# EAGLE design control_unit-smd (EAGLE 5.11)

## Sheet 1 of 4
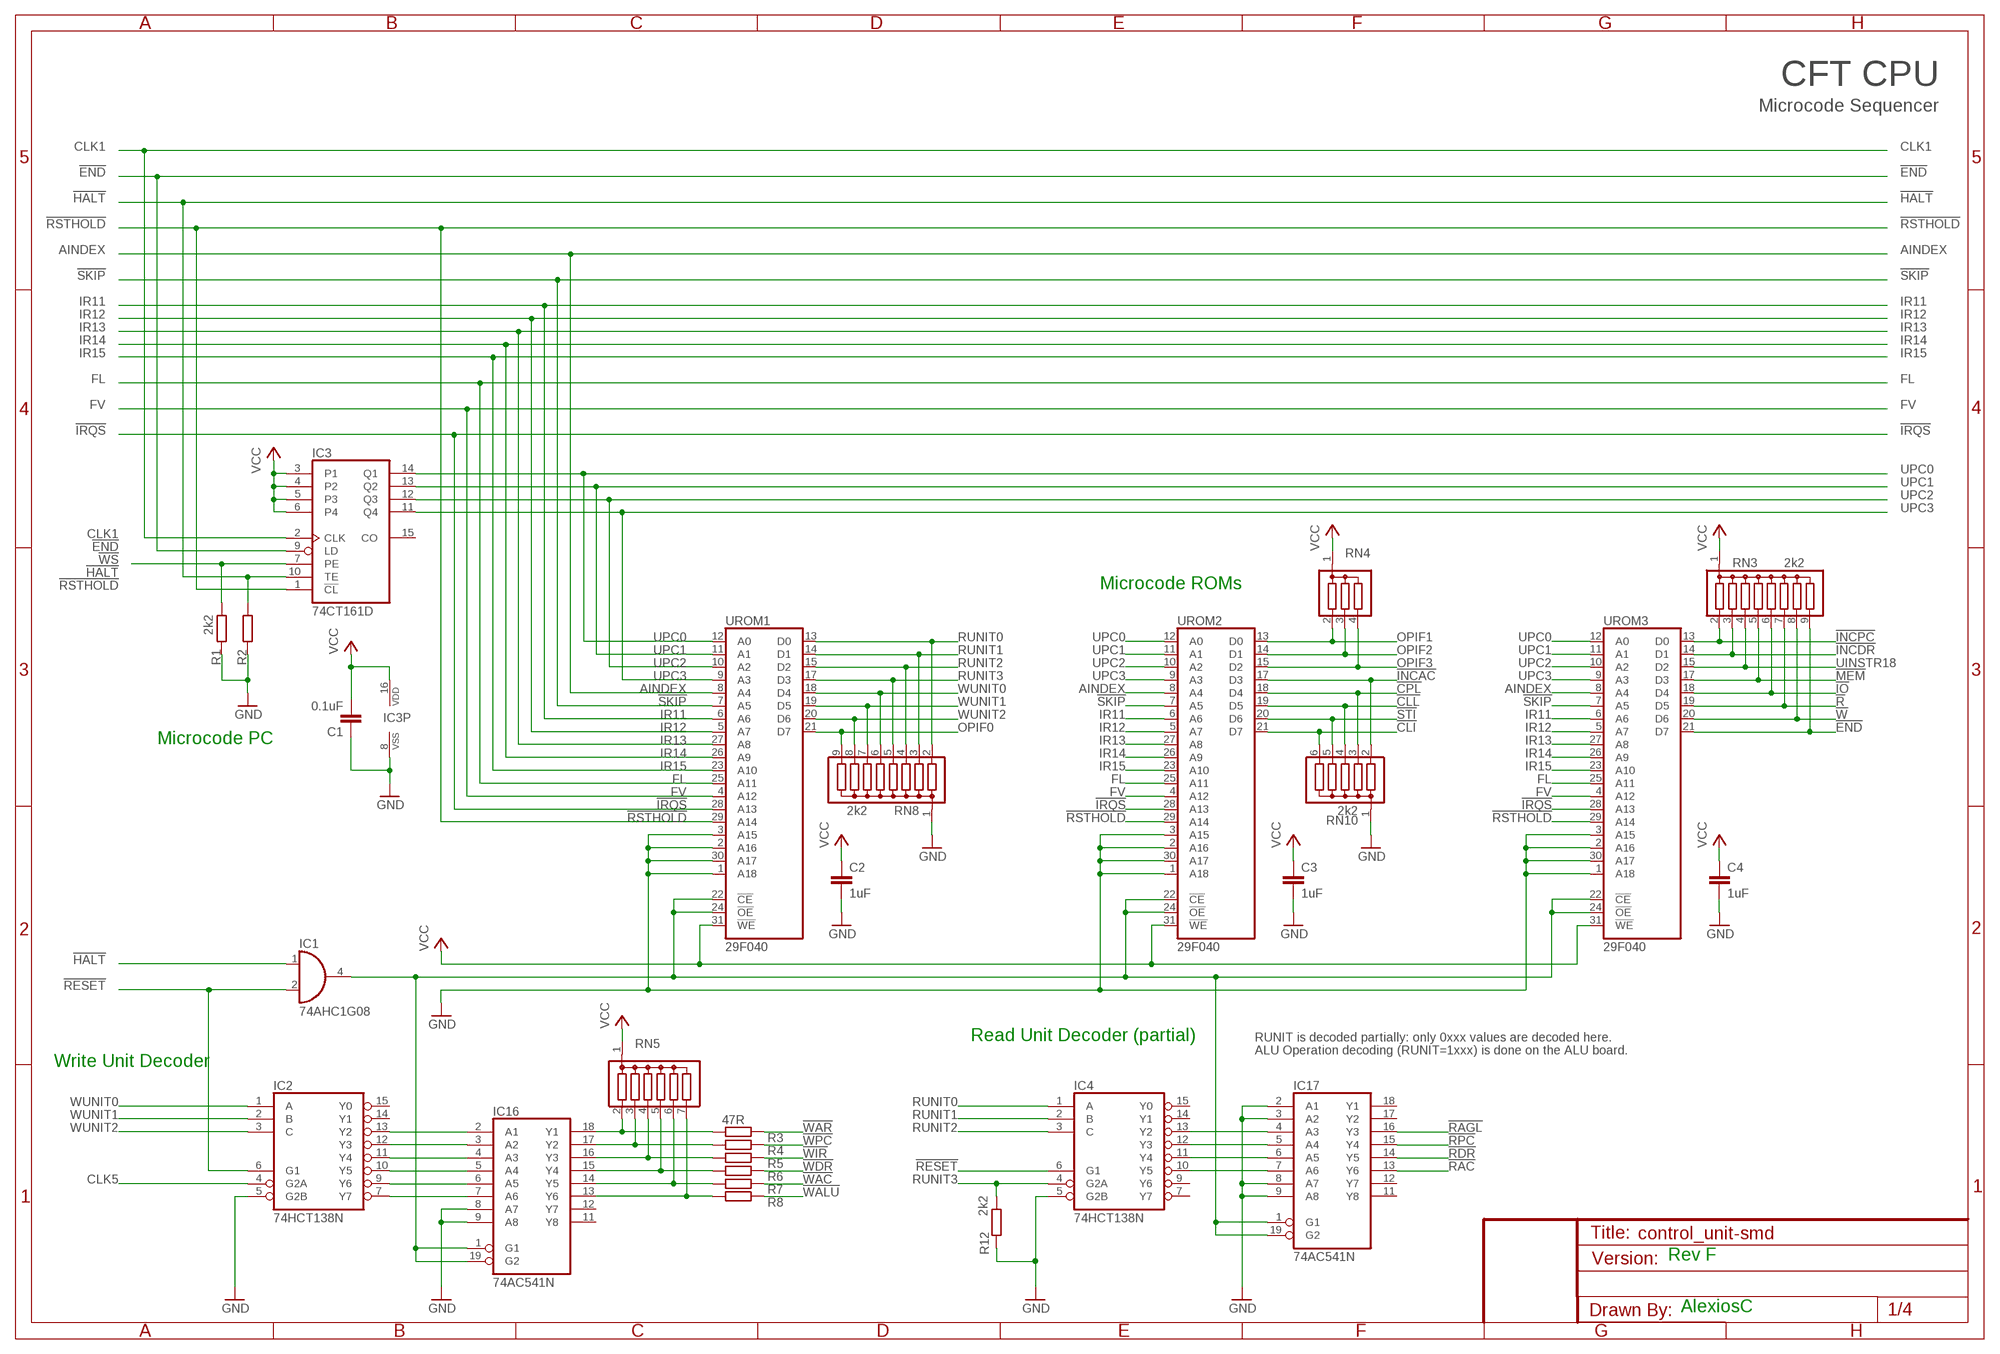
[diagram p0: schematic, sheet 1]

### Parts
C1  0.1uF  C-EUC0805K  [C0805K]
C2  1uF  C-EUC0805K  [C0805K]
C3  1uF  C-EUC0805K  [C0805K]
C4  1uF  C-EUC0805K  [C0805K]
IC1  74AHC1G08  74AHC1G08DBV  [SOT23-5]
IC2  74HCT138N  [DIL16]
IC3  74CT161D  4161P  [DIL16]
IC4  74HCT138N  [DIL16]
IC16  74AC541N  [DIL20]
IC17  74AC541N  [DIL20]
R1  2k2  R-EU_R0805W  [R0805W]
R2  2k2  R-EU_R0805W  [R0805W]
R3  47R  R-EU_R0805W  [R0805W]
R4  47R  R-EU_R0805W  [R0805W]
R5  47R  R-EU_R0805W  [R0805W]
R6  47R  R-EU_R0805W  [R0805W]
R7  47R  R-EU_R0805W  [R0805W]
R8  47R  R-EU_R0805W  [R0805W]
R12  2k2  R-EU_R0805W  [R0805W]
RN3  2k2  G08R  [SIL9]
RN4  G03R  [SIL4]
RN5  G06R  [SIL7]
RN8  2k2  G08R  [SIL9]
RN10  2k2  G05R  [SIL6]
UROM1  29F040  29F040DIP32  [DIL32]
UROM2  29F040  29F040DIP32  [DIL32]
UROM3  29F040  29F040DIP32  [DIL32]

### Nets
!CLI: RN10.6 UROM2.21(D7) ; also sheet 4
!CLL: RN10.4 UROM2.19(D5) ; also sheet 4
!CPL: RN10.3 UROM2.18(D4) ; also sheet 4
!END: IC3.9(LD) RN3.9 UROM3.21(D7) ; also sheet 4
!HALT: IC1.1(I0) IC3.10(TE) R2.2 ; also sheet 4
!INCAC: RN10.2 UROM2.17(D3) ; also sheet 4
!INCDR: RN3.3 UROM3.14(D1) ; also sheet 4
!INCPC: RN3.2 UROM3.13(D0) ; also sheet 4
!IO: RN3.6 UROM3.18(D4) ; also sheet 4
!IRQS: UROM1.28(A13) UROM2.28(A13) UROM3.28(A13) ; also sheet 4
!MEM: RN3.5 UROM3.17(D3) ; also sheet 4
!R: RN3.7 UROM3.19(D5) ; also sheet 4
!RAC: IC17.13(Y6) ; also sheet 4
!RAGL: IC17.16(Y3) ; also sheet 3
!RDR: IC17.14(Y5) ; also sheet 4
!RESET: IC1.2(I1) IC2.6(G1) IC4.6(G1) ; also sheet 2,3,4
!RPC: IC17.15(Y4) ; also sheet 4
!RSTHOLD: IC3.1(!CL) UROM1.29(A14) UROM2.29(A14) UROM3.29(A14) ; also sheet 4
!SKIP: UROM1.7(A5) UROM2.7(A5) UROM3.7(A5) ; also sheet 2
!STI: RN10.5 UROM2.20(D6) ; also sheet 4
!UCE: IC1.4(O) IC16.1(G1) IC16.19(G2) IC17.1(G1) IC17.19(G2) UROM1.22(!CE) UROM1.24(!OE) UROM2.22(!CE) UROM2.24(!OE) UROM3.22(!CE) UROM3.24(!OE)
!W: RN3.8 UROM3.20(D6) ; also sheet 4
!WAC: R7.2 ; also sheet 4
!WALU: R8.2 ; also sheet 4
!WAR: R3.2 ; also sheet 4
!WDR: R6.2 ; also sheet 4
!WIR: R5.2 ; also sheet 3,4
!WPC: R4.2 ; also sheet 4
!WS: IC3.7(PE) R1.2 ; also sheet 4
AINDEX: UROM1.8(A4) UROM2.8(A4) UROM3.8(A4) ; also sheet 4
CLK1: IC3.2(CLK) ; also sheet 2,4
CLK5: IC2.4(G2A) ; also sheet 4
FL: UROM1.25(A11) UROM2.25(A11) UROM3.25(A11) ; also sheet 2,4
FV: UROM1.4(A12) UROM2.4(A12) UROM3.4(A12) ; also sheet 2,4
GND [Power]: C1.1 C2.2 C3.2 C4.2 IC2.5(G2B) IC3.8(VSS) IC4.5(G2B) IC16.8(A7) IC16.9(A8) IC17.2(A1) IC17.3(A2) IC17.8(A7) IC17.9(A8) R1.1 R2.1 R12.1 RN8.1 RN10.1 UROM1.1(A18) UROM1.2(A16) UROM1.3(A15) UROM1.30(A17) UROM2.1(A18) UROM2.2(A16) UROM2.3(A15) UROM2.30(A17) UROM3.1(A18) UROM3.2(A16) UROM3.3(A15) UROM3.30(A17) ; also sheet 2,3,4
IR11: UROM1.6(A6) UROM2.6(A6) UROM3.6(A6) ; also sheet 3
IR12: UROM1.5(A7) UROM2.5(A7) UROM3.5(A7) ; also sheet 3
IR13: UROM1.27(A8) UROM2.27(A8) UROM3.27(A8) ; also sheet 3
IR14: UROM1.26(A9) UROM2.26(A9) UROM3.26(A9) ; also sheet 3
IR15: UROM1.23(A10) UROM2.23(A10) UROM3.23(A10) ; also sheet 3
N$1: IC16.18(Y1) R3.1 RN5.2
N$2: IC16.17(Y2) R4.1 RN5.3
N$7: IC2.13(Y2) IC16.2(A1)
N$8: IC2.12(Y3) IC16.3(A2)
N$9: IC2.11(Y4) IC16.4(A3)
N$10: IC2.10(Y5) IC16.5(A4)
N$11: IC2.9(Y6) IC16.6(A5)
N$12: IC2.7(Y7) IC16.7(A6)
N$13: IC16.16(Y3) R5.1 RN5.4
N$14: IC16.15(Y4) R6.1 RN5.5
N$15: IC16.14(Y5) R7.1 RN5.6
N$16: IC16.13(Y6) R8.1 RN5.7
N$19: IC4.13(Y2) IC17.4(A3)
N$20: IC4.12(Y3) IC17.5(A4)
N$21: IC4.11(Y4) IC17.6(A5)
N$22: IC4.10(Y5) IC17.7(A6)
OPIF0: RN8.9 UROM1.21(D7) ; also sheet 2
OPIF1: RN4.2 UROM2.13(D0) ; also sheet 2
OPIF2: RN4.3 UROM2.14(D1) ; also sheet 2
OPIF3: RN4.4 UROM2.15(D2) ; also sheet 2
RUNIT0: IC4.1(A) RN8.2 UROM1.13(D0)
RUNIT1: IC4.2(B) RN8.3 UROM1.14(D1)
RUNIT2: IC4.3(C) RN8.4 UROM1.15(D2)
RUNIT3: IC4.4(G2A) R12.2 RN8.5 UROM1.17(D3)
UINSTR18: RN3.4 UROM3.15(D2) ; also sheet 4
UPC0: IC3.14(Q1) UROM1.12(A0) UROM2.12(A0) UROM3.12(A0)
UPC1: IC3.13(Q2) UROM1.11(A1) UROM2.11(A1) UROM3.11(A1)
UPC2: IC3.12(Q3) UROM1.10(A2) UROM2.10(A2) UROM3.10(A2)
UPC3: IC3.11(Q4) UROM1.9(A3) UROM2.9(A3) UROM3.9(A3)
VCC [Power]: C1.2 C2.1 C3.1 C4.1 IC3.3(P1) IC3.4(P2) IC3.5(P3) IC3.6(P4) IC3.16(VDD) RN3.1 RN4.1 RN5.1 UROM1.31(!WE) UROM2.31(!WE) UROM3.31(!WE) ; also sheet 2,3,4
WUNIT0: IC2.1(A) RN8.6 UROM1.18(D4)
WUNIT1: IC2.2(B) RN8.7 UROM1.19(D5)
WUNIT2: IC2.3(C) RN8.8 UROM1.20(D6)
Unconnected: IC2.14(Y1) IC2.15(Y0) IC3.15(CO) IC4.7(Y7) IC4.9(Y6) IC4.14(Y1) IC4.15(Y0) IC16.11(Y8) IC16.12(Y7) IC17.11(Y8) IC17.12(Y7) IC17.17(Y2) IC17.18(Y1)

### Notes on the sheet
- CFT CPU
- Microcode Sequencer
- Microcode ROMs
- Microcode PC
- Read Unit Decoder (partial) | RUNIT is decoded partially: only 0xxx values are decoded here.
- ALU Operation decoding (RUNIT=1xxx) is done on the ALU board.
- Write Unit Decoder
- Rev F
- AlexiosC

## Sheet 2 of 4
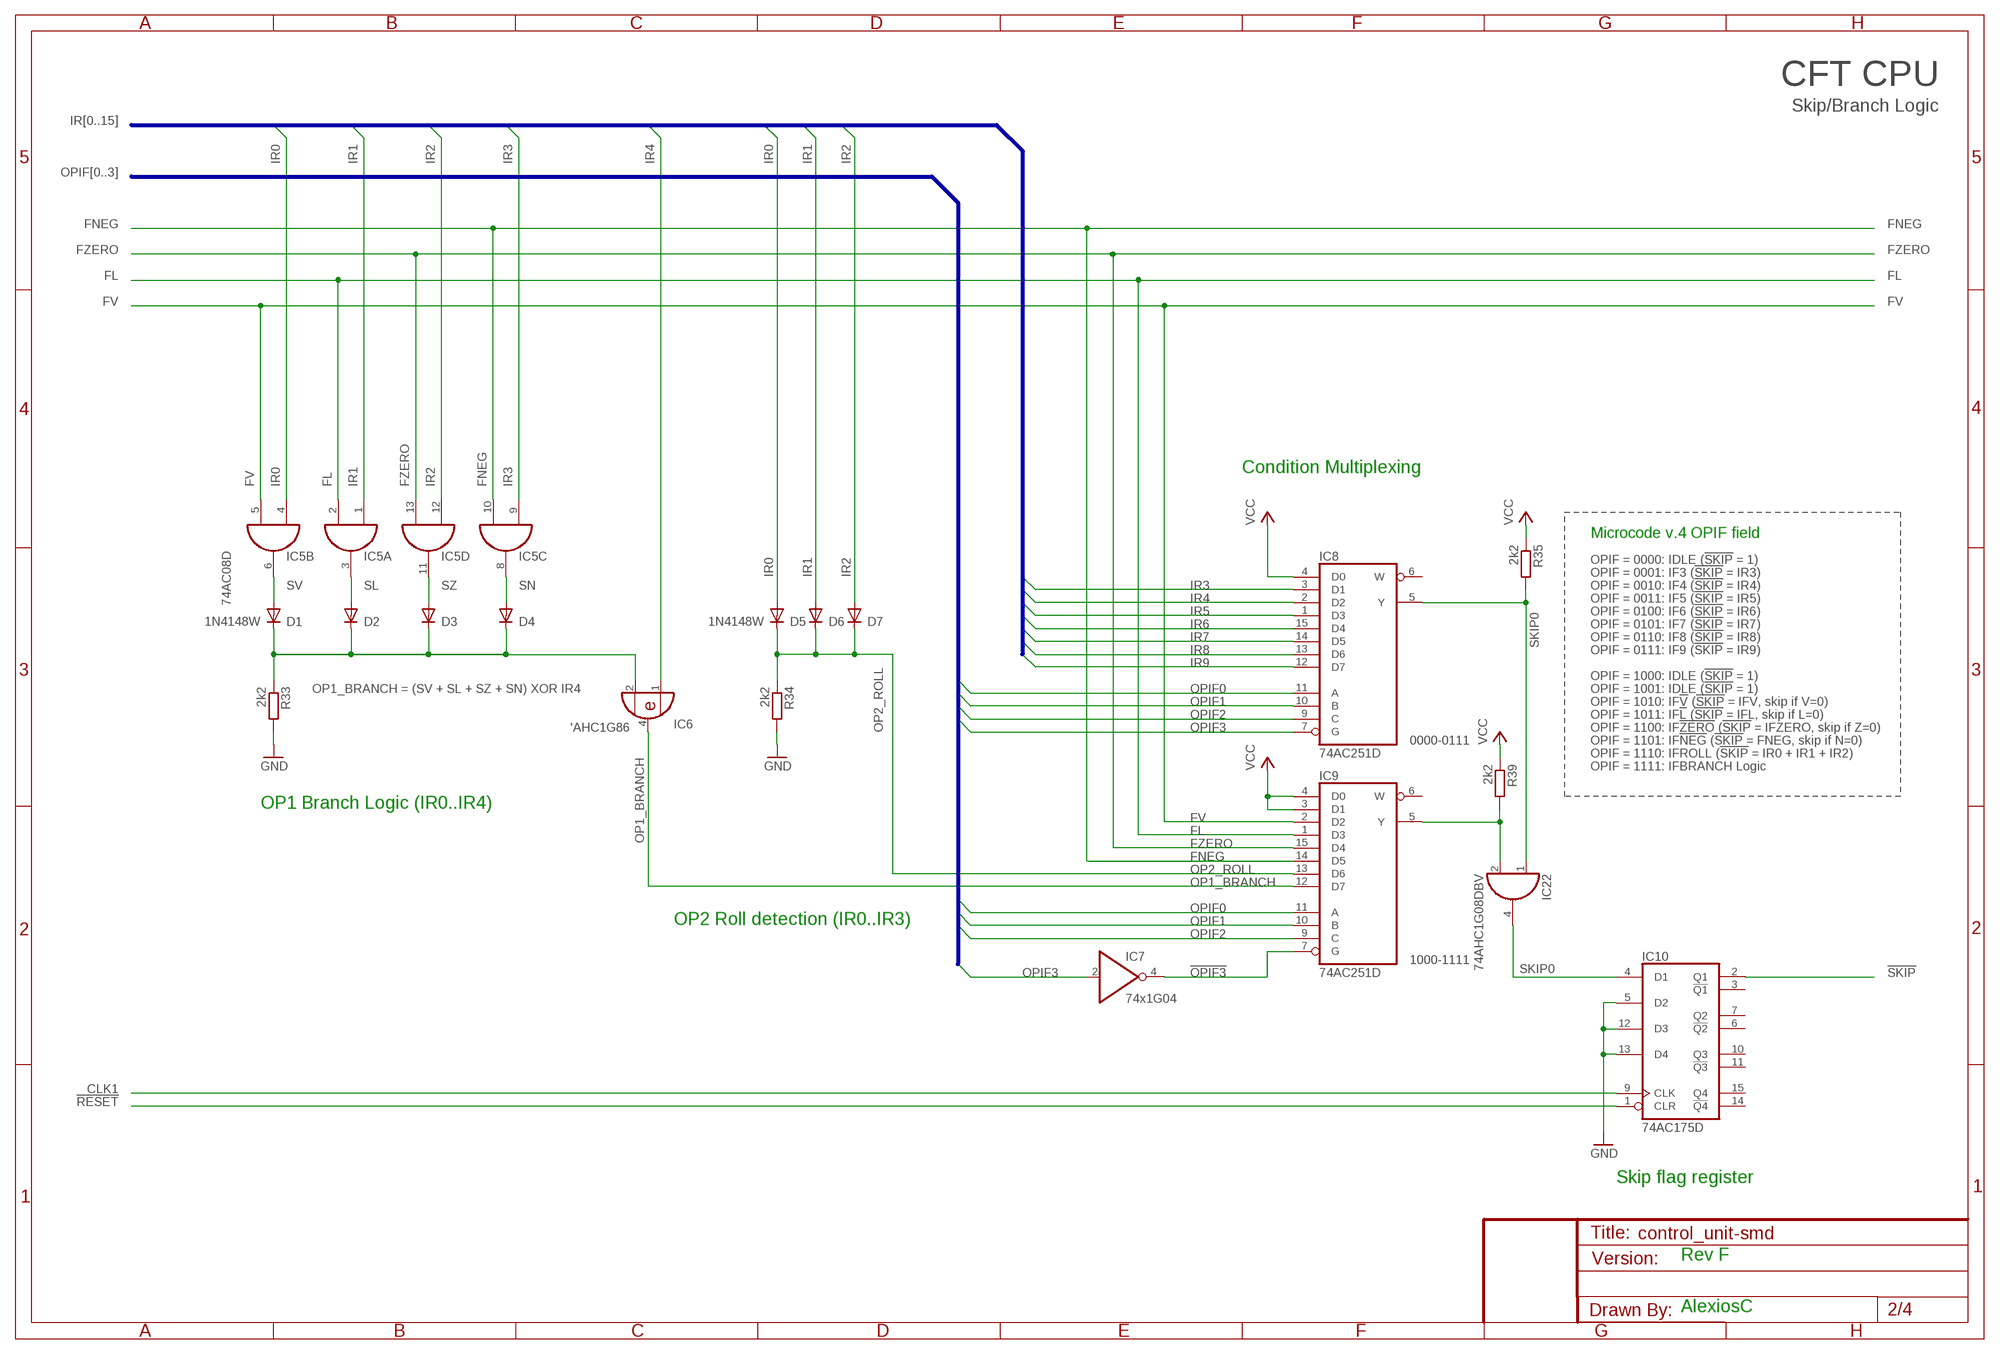
[diagram p1: schematic, sheet 2]

### Parts
D1  1N4148W  DIODE-SOD123  [SOD123]
D2  1N4148W  DIODE-SOD123  [SOD123]
D3  1N4148W  DIODE-SOD123  [SOD123]
D4  1N4148W  DIODE-SOD123  [SOD123]
D5  1N4148W  DIODE-SOD123  [SOD123]
D6  1N4148W  DIODE-SOD123  [SOD123]
D7  1N4148W  DIODE-SOD123  [SOD123]
IC5  74AC08D  [SO14]
IC6  'AHC1G86  74AHC1G86DBV  [SOT23-5]
IC7  74x1G04  74AHC1G04DBV  [SOT23-5]
IC8  74AC251D  [SO16]
IC9  74AC251D  [SO16]
IC10  74AC175D  [SO16]
IC22  74AHC1G08DBV  [SOT23-5]
R33  2k2  R-EU_R0805  [R0805]
R34  2k2  R-EU_R0805  [R0805]
R35  2k2  R-EU_R0805  [R0805]
R39  2k2  R-EU_R0805  [R0805]

### Nets
!OPIF3: IC7.4(O) IC9.7(G)
!RESET: IC10.1(CLR) ; also sheet 1,3,4
!SKIP: IC10.2(Q1) ; also sheet 1
CLK1: IC10.9(CLK) ; also sheet 1,4
FL: IC5.2(A:I1) IC9.1(D3) ; also sheet 1,4
FNEG: IC5.10(C:I1) IC9.14(D5) ; also sheet 4
FV: IC5.5(B:I1) IC9.2(D2) ; also sheet 1,4
FZERO: IC5.13(D:I1) IC9.15(D4) ; also sheet 4
GND [Power]: IC10.5(D2) IC10.12(D3) IC10.13(D4) R33.2 R34.2 ; also sheet 1,3,4
IR0: D5.A IC5.4(B:I0) ; also sheet 3
IR1: D6.A IC5.1(A:I0) ; also sheet 3
IR2: D7.A IC5.12(D:I0) ; also sheet 3
IR3: IC5.9(C:I0) IC8.3(D1) ; also sheet 3
IR4: IC6.1(I0) IC8.2(D2) ; also sheet 3
IR5: IC8.1(D3) ; also sheet 3
IR6: IC8.15(D4) ; also sheet 3
IR7: IC8.14(D5) ; also sheet 3
IR8: IC8.13(D6) ; also sheet 3
IR9: IC8.12(D7) ; also sheet 3
N$66: D1.C D2.C D3.C D4.C IC6.2(I1) R33.1
OP1_BRANCH: IC6.4(O) IC9.12(D7)
OP2_ROLL: D5.C D6.C D7.C IC9.13(D6) R34.1
OPIF0: IC8.11(A) IC9.11(A) ; also sheet 1
OPIF1: IC8.10(B) IC9.10(B) ; also sheet 1
OPIF2: IC8.9(C) IC9.9(C) ; also sheet 1
OPIF3: IC7.2(I) IC8.7(G) ; also sheet 1
SKIP0: IC10.4(D1) IC22.4(O)
SKIPMUXHI: IC9.5(Y) IC22.2(I1) R39.2
SKIPMUXLO: IC8.5(Y) IC22.1(I0) R35.2
SL: D2.A IC5.3(A:O)
SN: D4.A IC5.8(C:O)
SV: D1.A IC5.6(B:O)
SZ: D3.A IC5.11(D:O)
VCC [Power]: IC8.4(D0) IC9.3(D1) IC9.4(D0) R35.1 R39.1 ; also sheet 1,3,4
Unconnected: IC8.6(W) IC9.6(W) IC10.3(!Q1) IC10.6(!Q2) IC10.7(Q2) IC10.10(Q3) IC10.11(!Q3) IC10.14(!Q4) IC10.15(Q4)

### Buses
IR[0..15]
OPIF[0..3]

### Notes on the sheet
- CFT CPU
- Skip/Branch Logic
- Condition Multiplexing
- Microcode v.4 OPIF field
- OPIF = 0000: IDLE (!SKIP! = 1)
- OPIF = 0001: IF3 (!SKIP! = IR3)
- OPIF = 0010: IF4 (!SKIP! = IR4)
- OPIF = 0011: IF5 (!SKIP! = IR5)
- OPIF = 0100: IF6 (!SKIP! = IR6)
- OPIF = 0101: IF7 (!SKIP! = IR7)
- OPIF = 0110: IF8 (!SKIP! = IR8)
- OPIF = 0111: IF9 (!SKIP! = IR9)
- OPIF = 1000: IDLE (!SKIP! = 1)
- OP1_BRANCH = (SV + SL + SZ + SN) XOR IR4 | OPIF = 1001: IDLE (!SKIP! = 1)
- OPIF = 1010: IF!V! (!SKIP! = IFV, skip if V=0)
- OPIF = 1011: IF!L! (!SKIP! = IFL, skip if L=0)
- OPIF = 1100: IF!ZERO! (!SKIP! = IFZERO, skip if Z=0)
- 0000-0111 | OPIF = 1101: IF!NEG! (!SKIP! = FNEG, skip if N=0)
- OPIF = 1110: IFROLL (!SKIP! = IR0 + IR1 + IR2)
- OPIF = 1111: IFBRANCH Logic
- OP1 Branch Logic (IR0..IR4)
- OP2 Roll detection (IR0..IR3)
- 1000-1111
- Skip flag register
- Rev F
- AlexiosC

## Sheet 3 of 4
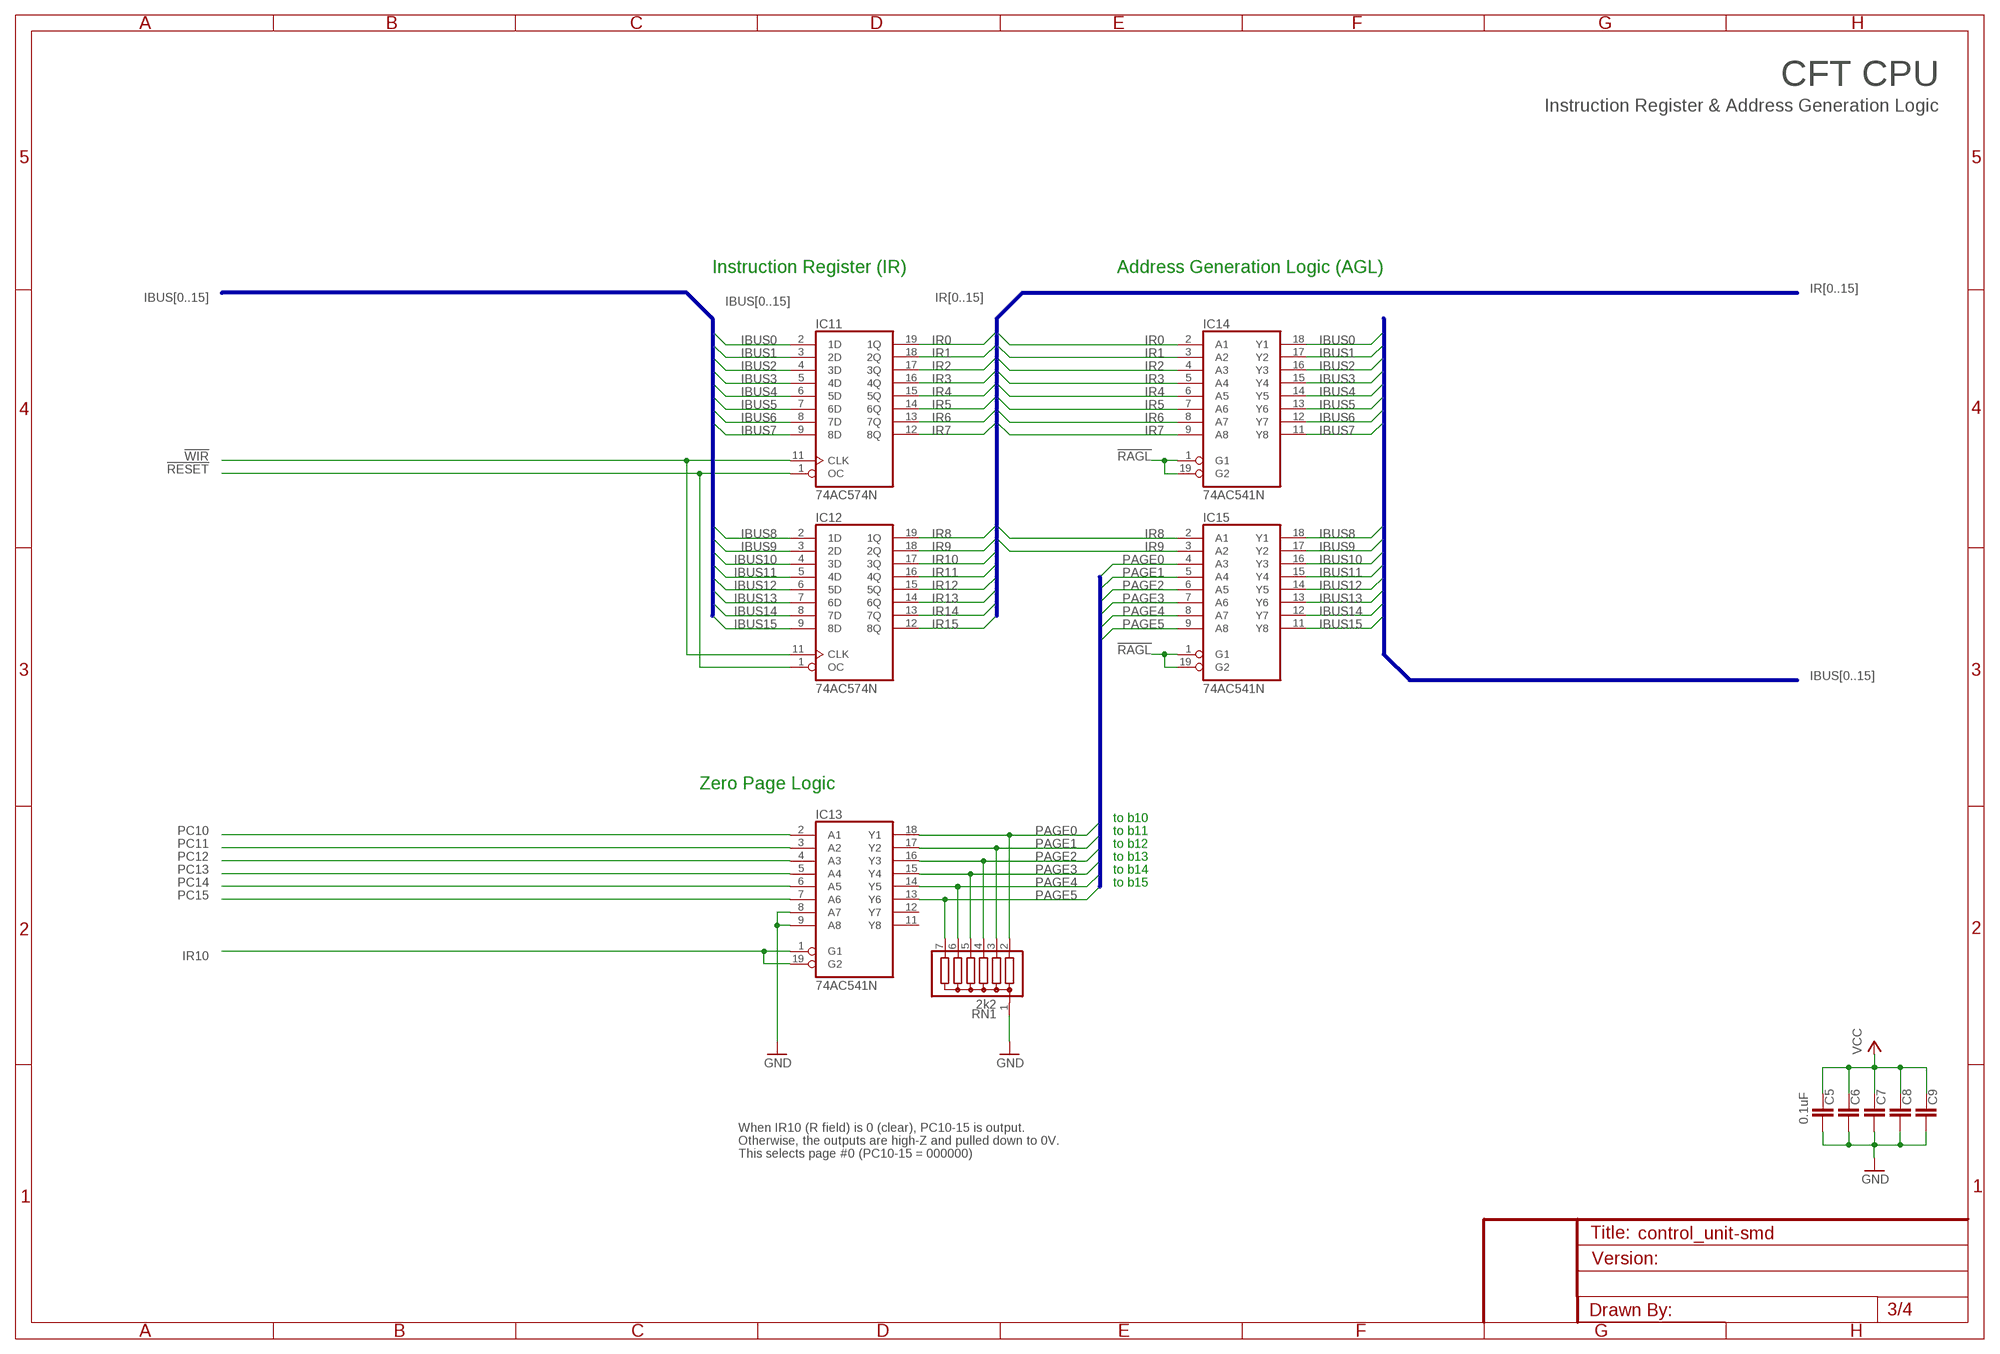
[diagram p2: schematic, sheet 3]

### Parts
C5  0.1uF  C-EUC0805K  [C0805K]
C6  0.1uF  C-EUC0805K  [C0805K]
C7  0.1uF  C-EUC0805K  [C0805K]
C8  0.1uF  C-EUC0805K  [C0805K]
C9  0.1uF  C-EUC0805K  [C0805K]
IC11  74AC574N  [DIL20]
IC12  74AC574N  [DIL20]
IC13  74AC541N  [DIL20]
IC14  74AC541N  [DIL20]
IC15  74AC541N  [DIL20]
RN1  2k2  G06R  [SIL7]

### Nets
!RAGL: IC14.1(G1) IC14.19(G2) IC15.1(G1) IC15.19(G2) ; also sheet 1
!RESET: IC11.1(OC) IC12.1(OC) ; also sheet 1,2,4
!WIR: IC11.11(CLK) IC12.11(CLK) ; also sheet 1,4
GND [Power]: C5.2 C6.2 C7.2 C8.2 C9.2 IC13.8(A7) IC13.9(A8) RN1.1 ; also sheet 1,2,4
IBUS0: IC11.2(1D) IC14.18(Y1) ; also sheet 4
IBUS1: IC11.3(2D) IC14.17(Y2) ; also sheet 4
IBUS2: IC11.4(3D) IC14.16(Y3) ; also sheet 4
IBUS3: IC11.5(4D) IC14.15(Y4) ; also sheet 4
IBUS4: IC11.6(5D) IC14.14(Y5) ; also sheet 4
IBUS5: IC11.7(6D) IC14.13(Y6) ; also sheet 4
IBUS6: IC11.8(7D) IC14.12(Y7) ; also sheet 4
IBUS7: IC11.9(8D) IC14.11(Y8) ; also sheet 4
IBUS8: IC12.2(1D) IC15.18(Y1) ; also sheet 4
IBUS9: IC12.3(2D) IC15.17(Y2) ; also sheet 4
IBUS10: IC12.4(3D) IC15.16(Y3) ; also sheet 4
IBUS11: IC12.5(4D) IC15.15(Y4) ; also sheet 4
IBUS12: IC12.6(5D) IC15.14(Y5) ; also sheet 4
IBUS13: IC12.7(6D) IC15.13(Y6) ; also sheet 4
IBUS14: IC12.8(7D) IC15.12(Y7) ; also sheet 4
IBUS15: IC12.9(8D) IC15.11(Y8) ; also sheet 4
IR0: IC11.19(1Q) IC14.2(A1) ; also sheet 2
IR1: IC11.18(2Q) IC14.3(A2) ; also sheet 2
IR2: IC11.17(3Q) IC14.4(A3) ; also sheet 2
IR3: IC11.16(4Q) IC14.5(A4) ; also sheet 2
IR4: IC11.15(5Q) IC14.6(A5) ; also sheet 2
IR5: IC11.14(6Q) IC14.7(A6) ; also sheet 2
IR6: IC11.13(7Q) IC14.8(A7) ; also sheet 2
IR7: IC11.12(8Q) IC14.9(A8) ; also sheet 2
IR8: IC12.19(1Q) IC15.2(A1) ; also sheet 2
IR9: IC12.18(2Q) IC15.3(A2) ; also sheet 2
IR10: IC12.17(3Q) IC13.1(G1) IC13.19(G2)
IR11: IC12.16(4Q) ; also sheet 1
IR12: IC12.15(5Q) ; also sheet 1
IR13: IC12.14(6Q) ; also sheet 1
IR14: IC12.13(7Q) ; also sheet 1
IR15: IC12.12(8Q) ; also sheet 1
PAGE0: IC13.18(Y1) IC15.4(A3) RN1.2
PAGE1: IC13.17(Y2) IC15.5(A4) RN1.3
PAGE2: IC13.16(Y3) IC15.6(A5) RN1.4
PAGE3: IC13.15(Y4) IC15.7(A6) RN1.5
PAGE4: IC13.14(Y5) IC15.8(A7) RN1.6
PAGE5: IC13.13(Y6) IC15.9(A8) RN1.7
PC10: IC13.2(A1) ; also sheet 4
PC11: IC13.3(A2) ; also sheet 4
PC12: IC13.4(A3) ; also sheet 4
PC13: IC13.5(A4) ; also sheet 4
PC14: IC13.6(A5) ; also sheet 4
PC15: IC13.7(A6) ; also sheet 4
VCC [Power]: C5.1 C6.1 C7.1 C8.1 C9.1 ; also sheet 1,2,4
Unconnected: IC13.11(Y8) IC13.12(Y7)

### Buses
IBUS[0..15]
IR[0..15]
PAGE[0..5]

### Notes on the sheet
- CFT CPU
- Instruction Register & Address Generation Logic
- Instruction Register (IR) | Address Generation Logic (AGL)
- Zero Page Logic
- to b10
- to b11
- to b12
- to b13
- to b14
- to b15
- When IR10 (R field) is 0 (clear), PC10-15 is output.
- Otherwise, the outputs are high-Z and pulled down to 0V.
- This selects page #0 (PC10-15 = 000000)

## Sheet 4 of 4
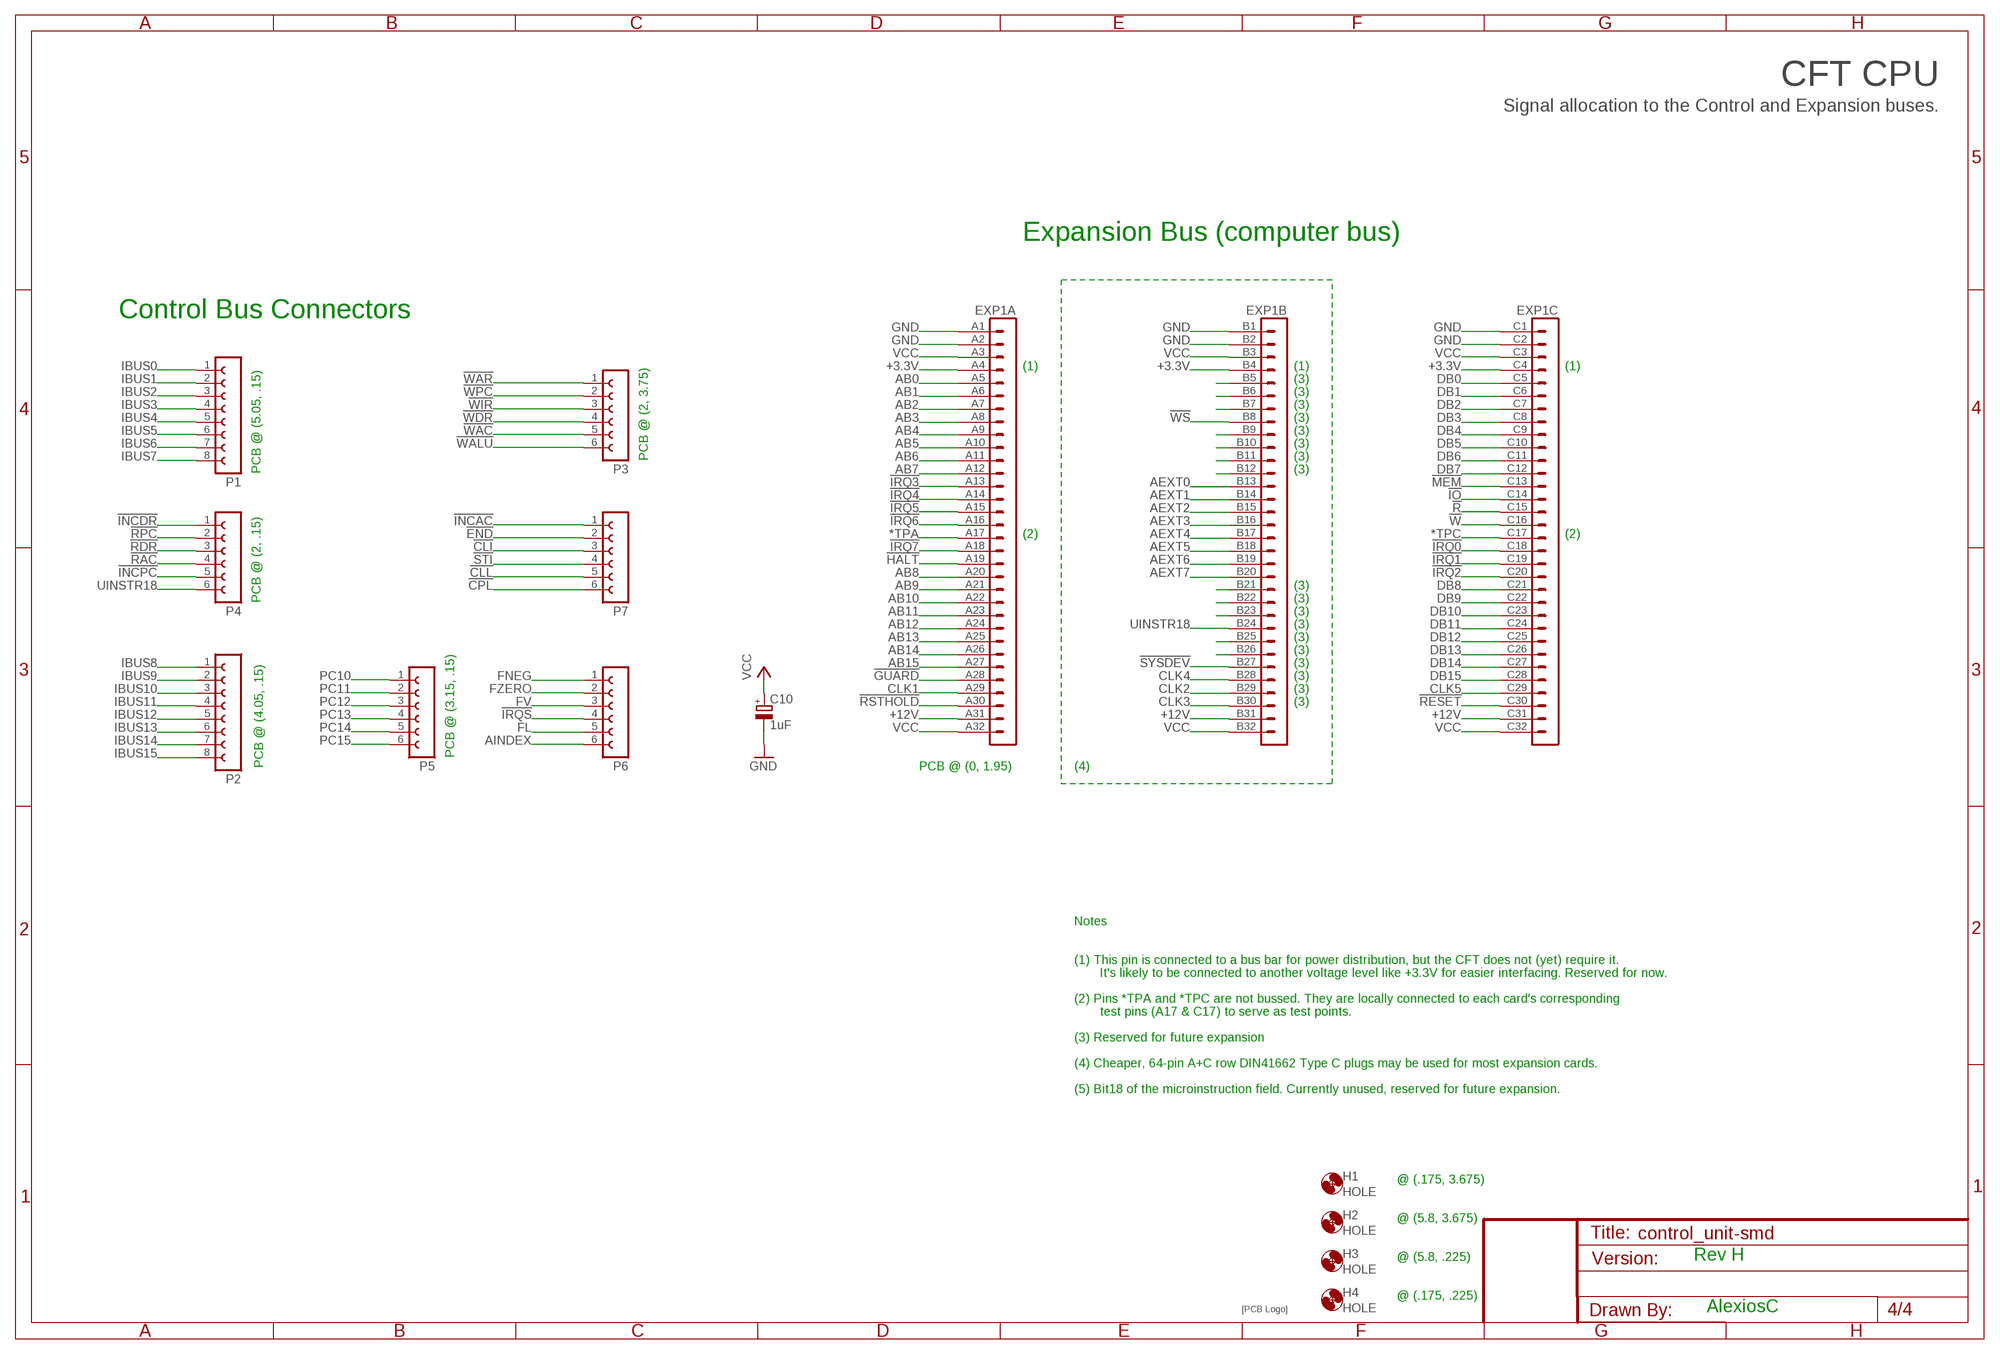
[diagram p3: schematic, sheet 4]

### Parts
C10  1uF  CPOL-EUE2.5-5  [E2,5-5]
EXP1  VG96-3K  [VG96K]
H1  HOLE  [STANDOFF_28_60]
H2  HOLE  [STANDOFF_28_60]
H3  HOLE  [STANDOFF_28_60]
H4  HOLE  [STANDOFF_28_60]
P1  FE08-1  [FE08]
P2  FE08-1  [FE08]
P3  FE06-1  [FE06]
P4  FE06-1  [FE06]
P5  FE06-1  [FE06]
P6  FE06-1  [FE06]
P7  FE06-1  [FE06]
U$1  SIGNATURESILK  [SIGNATURE]

### Nets
!CLI: P7.3 ; also sheet 1
!CLL: P7.5 ; also sheet 1
!CPL: P7.6 ; also sheet 1
!END: P7.2 ; also sheet 1
!GUARD: EXP1.A28
!HALT: EXP1.A19 ; also sheet 1
!INCAC: P7.1 ; also sheet 1
!INCDR: P4.1 ; also sheet 1
!INCPC: P4.5 ; also sheet 1
!IO: EXP1.C14 ; also sheet 1
!IRQ0: EXP1.C18
!IRQ1: EXP1.C19
!IRQ2: EXP1.C20
!IRQ3: EXP1.A13
!IRQ4: EXP1.A14
!IRQ5: EXP1.A15
!IRQ6: EXP1.A16
!IRQ7: EXP1.A18
!IRQS: P6.4 ; also sheet 1
!MEM: EXP1.C13 ; also sheet 1
!R: EXP1.C15 ; also sheet 1
!RAC: P4.4 ; also sheet 1
!RDR: P4.3 ; also sheet 1
!RESET: EXP1.C30 ; also sheet 1,2,3
!RPC: P4.2 ; also sheet 1
!RSTHOLD: EXP1.A30 ; also sheet 1
!STI: P7.4 ; also sheet 1
!SYSDEV: EXP1.B27
!W: EXP1.C16 ; also sheet 1
!WAC: P3.5 ; also sheet 1
!WALU: P3.6 ; also sheet 1
!WAR: P3.1 ; also sheet 1
!WDR: P3.4 ; also sheet 1
!WIR: P3.3 ; also sheet 1,3
!WPC: P3.2 ; also sheet 1
!WS: EXP1.B8 ; also sheet 1
*TPA: EXP1.A17
*TPC: EXP1.C17
+3.3V: EXP1.A4 EXP1.B4 EXP1.C4
+12V [12V]: EXP1.A31 EXP1.B31 EXP1.C31
AB0: EXP1.A5
AB1: EXP1.A6
AB2: EXP1.A7
AB3: EXP1.A8
AB4: EXP1.A9
AB5: EXP1.A10
AB6: EXP1.A11
AB7: EXP1.A12
AB8: EXP1.A20
AB9: EXP1.A21
AB10: EXP1.A22
AB11: EXP1.A23
AB12: EXP1.A24
AB13: EXP1.A25
AB14: EXP1.A26
AB15: EXP1.A27
AEXT0: EXP1.B13
AEXT1: EXP1.B14
AEXT2: EXP1.B15
AEXT3: EXP1.B16
AEXT4: EXP1.B17
AEXT5: EXP1.B18
AEXT6: EXP1.B19
AEXT7: EXP1.B20
AINDEX: P6.6 ; also sheet 1
CLK1: EXP1.A29 ; also sheet 1,2
CLK2: EXP1.B29
CLK3: EXP1.B30
CLK4: EXP1.B28
CLK5: EXP1.C29 ; also sheet 1
DB0: EXP1.C5
DB1: EXP1.C6
DB2: EXP1.C7
DB3: EXP1.C8
DB4: EXP1.C9
DB5: EXP1.C10
DB6: EXP1.C11
DB7: EXP1.C12
DB8: EXP1.C21
DB9: EXP1.C22
DB10: EXP1.C23
DB11: EXP1.C24
DB12: EXP1.C25
DB13: EXP1.C26
DB14: EXP1.C27
DB15: EXP1.C28
FL: P6.5 ; also sheet 1,2
FNEG: P6.1 ; also sheet 2
FV: P6.3 ; also sheet 1,2
FZERO: P6.2 ; also sheet 2
GND [Power]: C10.- EXP1.A1 EXP1.A2 EXP1.B1 EXP1.B2 EXP1.C1 EXP1.C2 ; also sheet 1,2,3
IBUS0: P1.1 ; also sheet 3
IBUS1: P1.2 ; also sheet 3
IBUS2: P1.3 ; also sheet 3
IBUS3: P1.4 ; also sheet 3
IBUS4: P1.5 ; also sheet 3
IBUS5: P1.6 ; also sheet 3
IBUS6: P1.7 ; also sheet 3
IBUS7: P1.8 ; also sheet 3
IBUS8: P2.1 ; also sheet 3
IBUS9: P2.2 ; also sheet 3
IBUS10: P2.3 ; also sheet 3
IBUS11: P2.4 ; also sheet 3
IBUS12: P2.5 ; also sheet 3
IBUS13: P2.6 ; also sheet 3
IBUS14: P2.7 ; also sheet 3
IBUS15: P2.8 ; also sheet 3
N$3: EXP1.B12
N$4: EXP1.B11
N$5: EXP1.B10
N$6: EXP1.B9
N$56: EXP1.B7
N$57: EXP1.B6
N$58: EXP1.B5
N$59: EXP1.B26
N$60: EXP1.B25
N$62: EXP1.B23
N$63: EXP1.B22
N$64: EXP1.B21
PC10: P5.1 ; also sheet 3
PC11: P5.2 ; also sheet 3
PC12: P5.3 ; also sheet 3
PC13: P5.4 ; also sheet 3
PC14: P5.5 ; also sheet 3
PC15: P5.6 ; also sheet 3
UINSTR18: EXP1.B24 P4.6 ; also sheet 1
VCC [Power]: C10.+ EXP1.A3 EXP1.A32 EXP1.B3 EXP1.B32 EXP1.C3 EXP1.C32 ; also sheet 1,2,3

### Notes on the sheet
- CFT CPU
- Signal allocation to the Control and Expansion buses.
- Expansion Bus (computer bus)
- Control Bus Connectors
- (1) | (1) | (1)
- (3)
- (3)
- (3)
- (3)
- (3)
- (3)
- PCB @ (2, 3.75) | (3)
- PCB @ (5.05, .15) | (3)
- (2) | (2)
- (3)
- PCB @ (2, .15) | (3)
- (3)
- (3)
- (3)
- (3)
- (3)
- (3)
- (3)
- (3)
- PCB @ (3.15, .15)
- PCB @ (4.05, .15) | PCB @ (0, 1.95) | (4)
- Notes
- (1) This pin is connected to a bus bar for power distribution, but the CFT does not (yet) require it.
- It's likely to be connected to another voltage level like +3.3V for easier interfacing. Reserved for now.
- (2) Pins *TPA and *TPC are not bussed. They are locally connected to each card's corresponding
- test pins (A17 & C17) to serve as test points.
- (3) Reserved for future expansion
- (4) Cheaper, 64-pin A+C row DIN41662 Type C plugs may be used for most expansion cards.
- (5) Bit18 of the microinstruction field. Currently unused, reserved for future expansion.
- @ (.175, 3.675)
- @ (5.8, 3.675)
- @ (5.8, .225) | Rev H
- @ (.175, .225)
- AlexiosC

## Power pins joined to a net without a drawn wire
GND: IC1.3(GND) IC2.8(GND) IC4.8(GND) IC5.7(P:GND) IC6.3(GND) IC7.3(GND) IC8.8(GND) IC9.8(GND) IC10.8(GND) IC11.10(GND) IC12.10(GND) IC13.10(GND) IC14.10(GND) IC15.10(GND) IC16.10(GND) IC17.10(GND) IC22.3(GND) UROM1.16(GND) UROM2.16(GND) UROM3.16(GND)
VCC: IC1.5(VCC) IC2.16(VCC) IC4.16(VCC) IC5.14(P:VCC) IC6.5(VCC) IC7.5(VCC) IC8.16(VCC) IC9.16(VCC) IC10.16(VCC) IC11.20(VCC) IC12.20(VCC) IC13.20(VCC) IC14.20(VCC) IC15.20(VCC) IC16.20(VCC) IC17.20(VCC) IC22.5(VCC) UROM1.32(VCC) UROM2.32(VCC) UROM3.32(VCC)

## Library data of the parts
C1-C9 = rcl:C-EU: CAPACITOR, European symbol
C10 = rcl:CPOL-EU: POLARIZED CAPACITOR, European symbol
D1-D7 = diode:DIODE-: DIODE
EXP1 = alexios-19inch:VG96-3: PCB EUROCARD, 96-pin type C/ABC, 2.54 mm
H1-H4 = alexios:HOLE: Hole for a standoff or mount. Hole diameter: 3.3mm. External Diameter: 6mm.
IC1 IC22 = 74xx-little-de:74*1G08: 2-input AND gate
IC2 IC4 = 74xx-eu:74*138: 3-line to 8-line DECODER/DEMULTIPLEXER
IC3 = 41xx:4161: 41xx DEVICE
IC5 = 74xx-eu:74*08: Quad 2-input AND gate
IC6 = 74xx-little-de:74*1G86: 2-input EXCLUSIV-OR gate
IC7 = 74xx-little-de:74*1G04: INVERTER Gate
IC8 IC9 = 74xx-eu:74*251: 1 of 8 data SELECTOR/MULTIPLEXER, 3-state
IC10 = 74xx-eu:74*175: Qadruple D type FLIP FLOP, clear
IC11 IC12 = 74xx-eu:74*574: 8-bit D type FLIP FLOP bus driver
IC13-IC17 = 74xx-eu:74*541: Octal BUFFER and LINE DRIVER, 3-state
P1 P2 = con-lsta:FE08-1: FEMALE HEADER; OC_FARNELL: unknown; OC_NEWARK: unknown
P3-P7 = con-lsta:FE06-1: FEMALE HEADER; OC_FARNELL: unknown; OC_NEWARK: unknown
R1-R8 R12 = resistor:R-EU_: RESISTOR, European symbol
R33-R35 R39 = rcl:R-EU_: RESISTOR, European symbol
RN1 RN5 = resistor-sil:G06R: SIL RESISTOR; OC_FARNELL: unknown; OC_NEWARK: unknown
RN3 RN8 = resistor-sil:G08R: SIL RESISTOR; OC_FARNELL: unknown; OC_NEWARK: unknown
RN4 = resistor-sil:G03R: SIL RESISTOR; OC_FARNELL: unknown; OC_NEWARK: unknown
RN10 = resistor-sil:G05R: SIL RESISTOR; OC_FARNELL: unknown; OC_NEWARK: unknown
U$1 = alexios:SIGNATURE: Soup signature
UROM1-UROM3 = alexios:29F040: 4-mbit (512x8) Flash memory in a PLCC32 package (with socket). AM29F040 is an example of this.

## Net classes
0 default: width 0.305 mm, clearance 0.254 mm
1 Power: width 0.635 mm, clearance 0.254 mm
2 12V: width 0.635 mm, clearance 0.635 mm

## Board
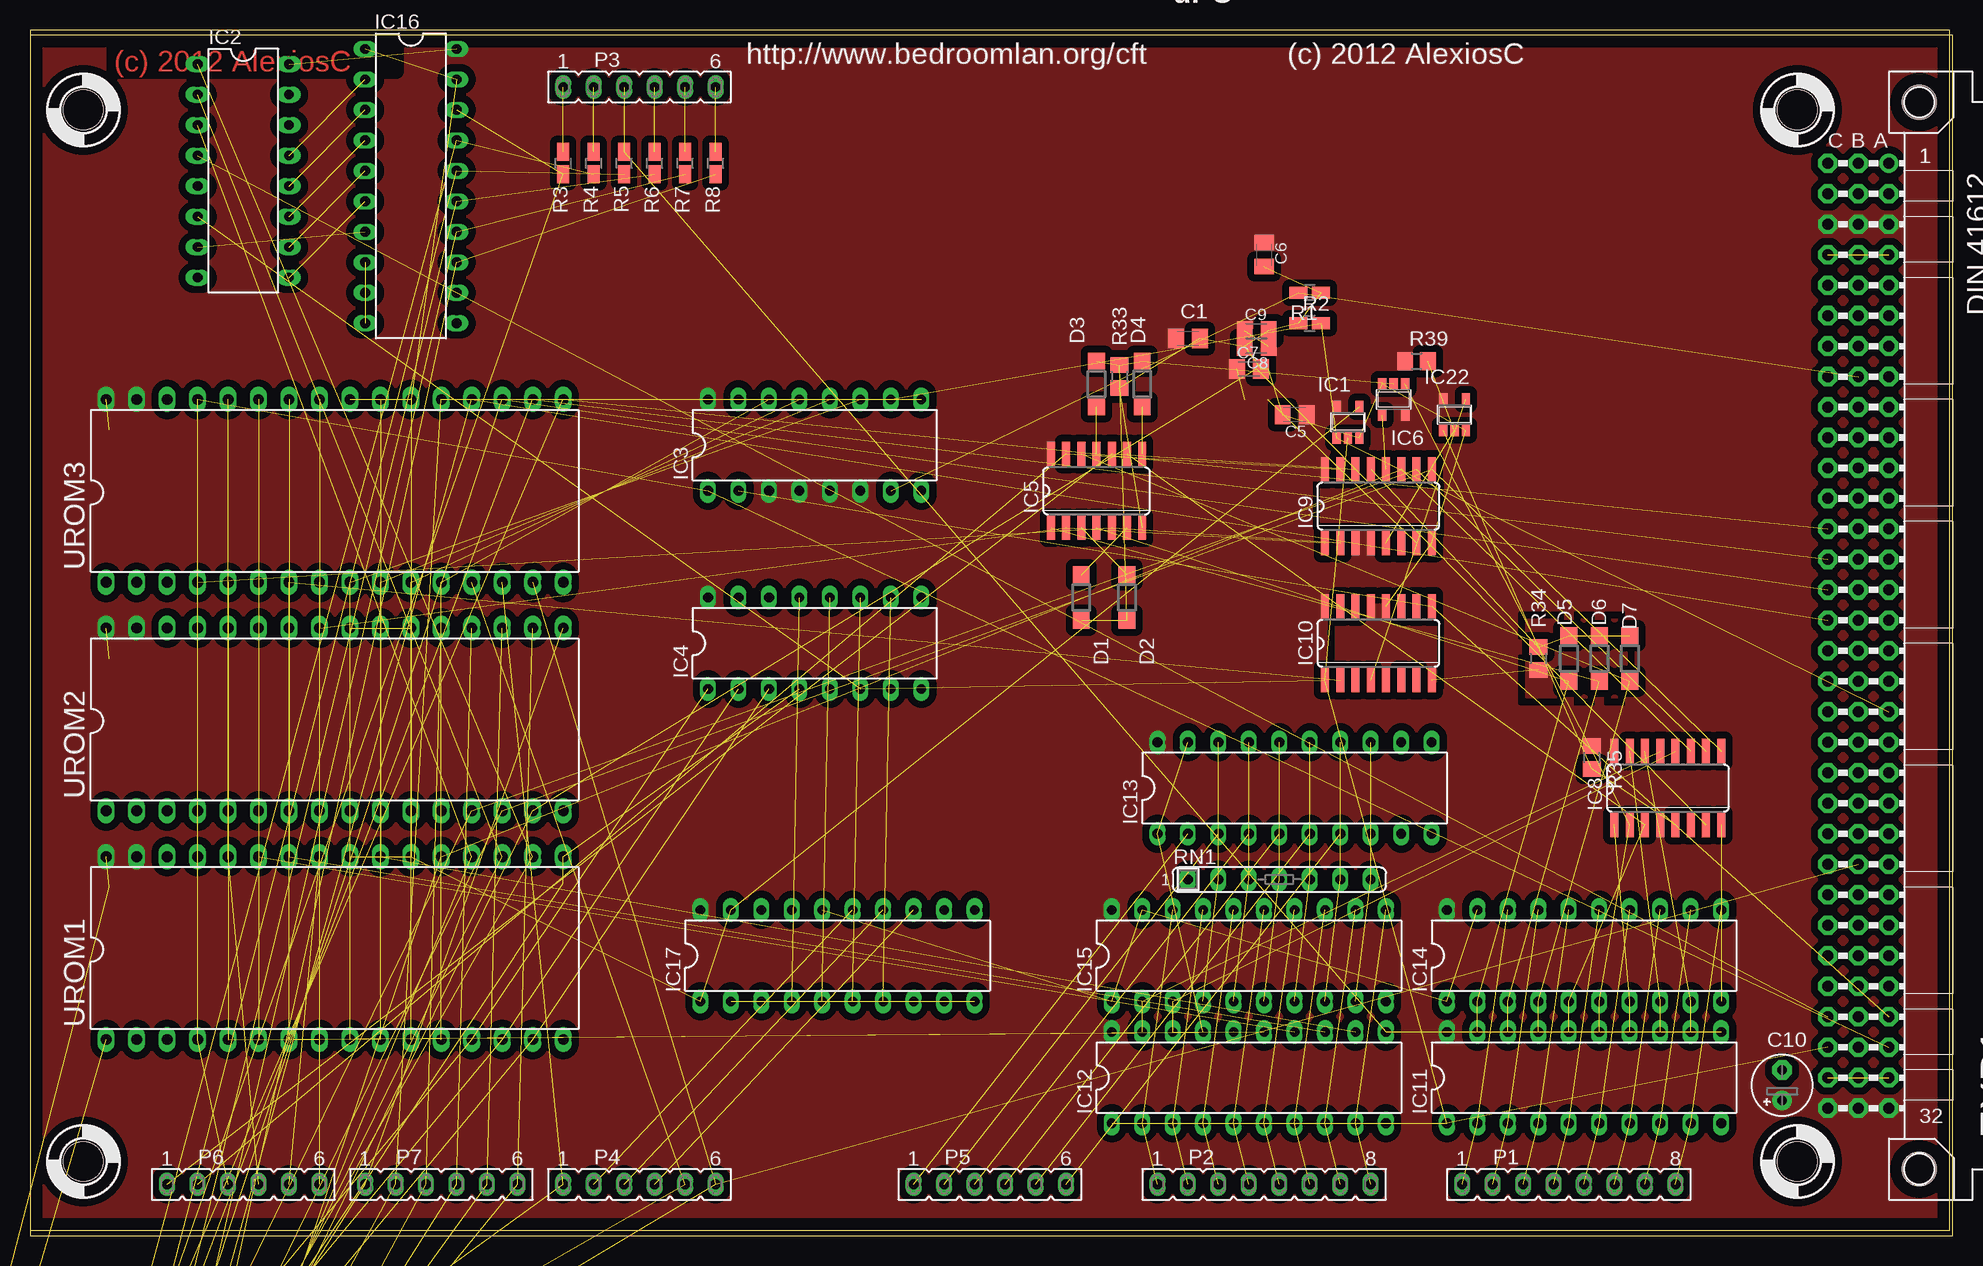
[diagram p4: board, top side]
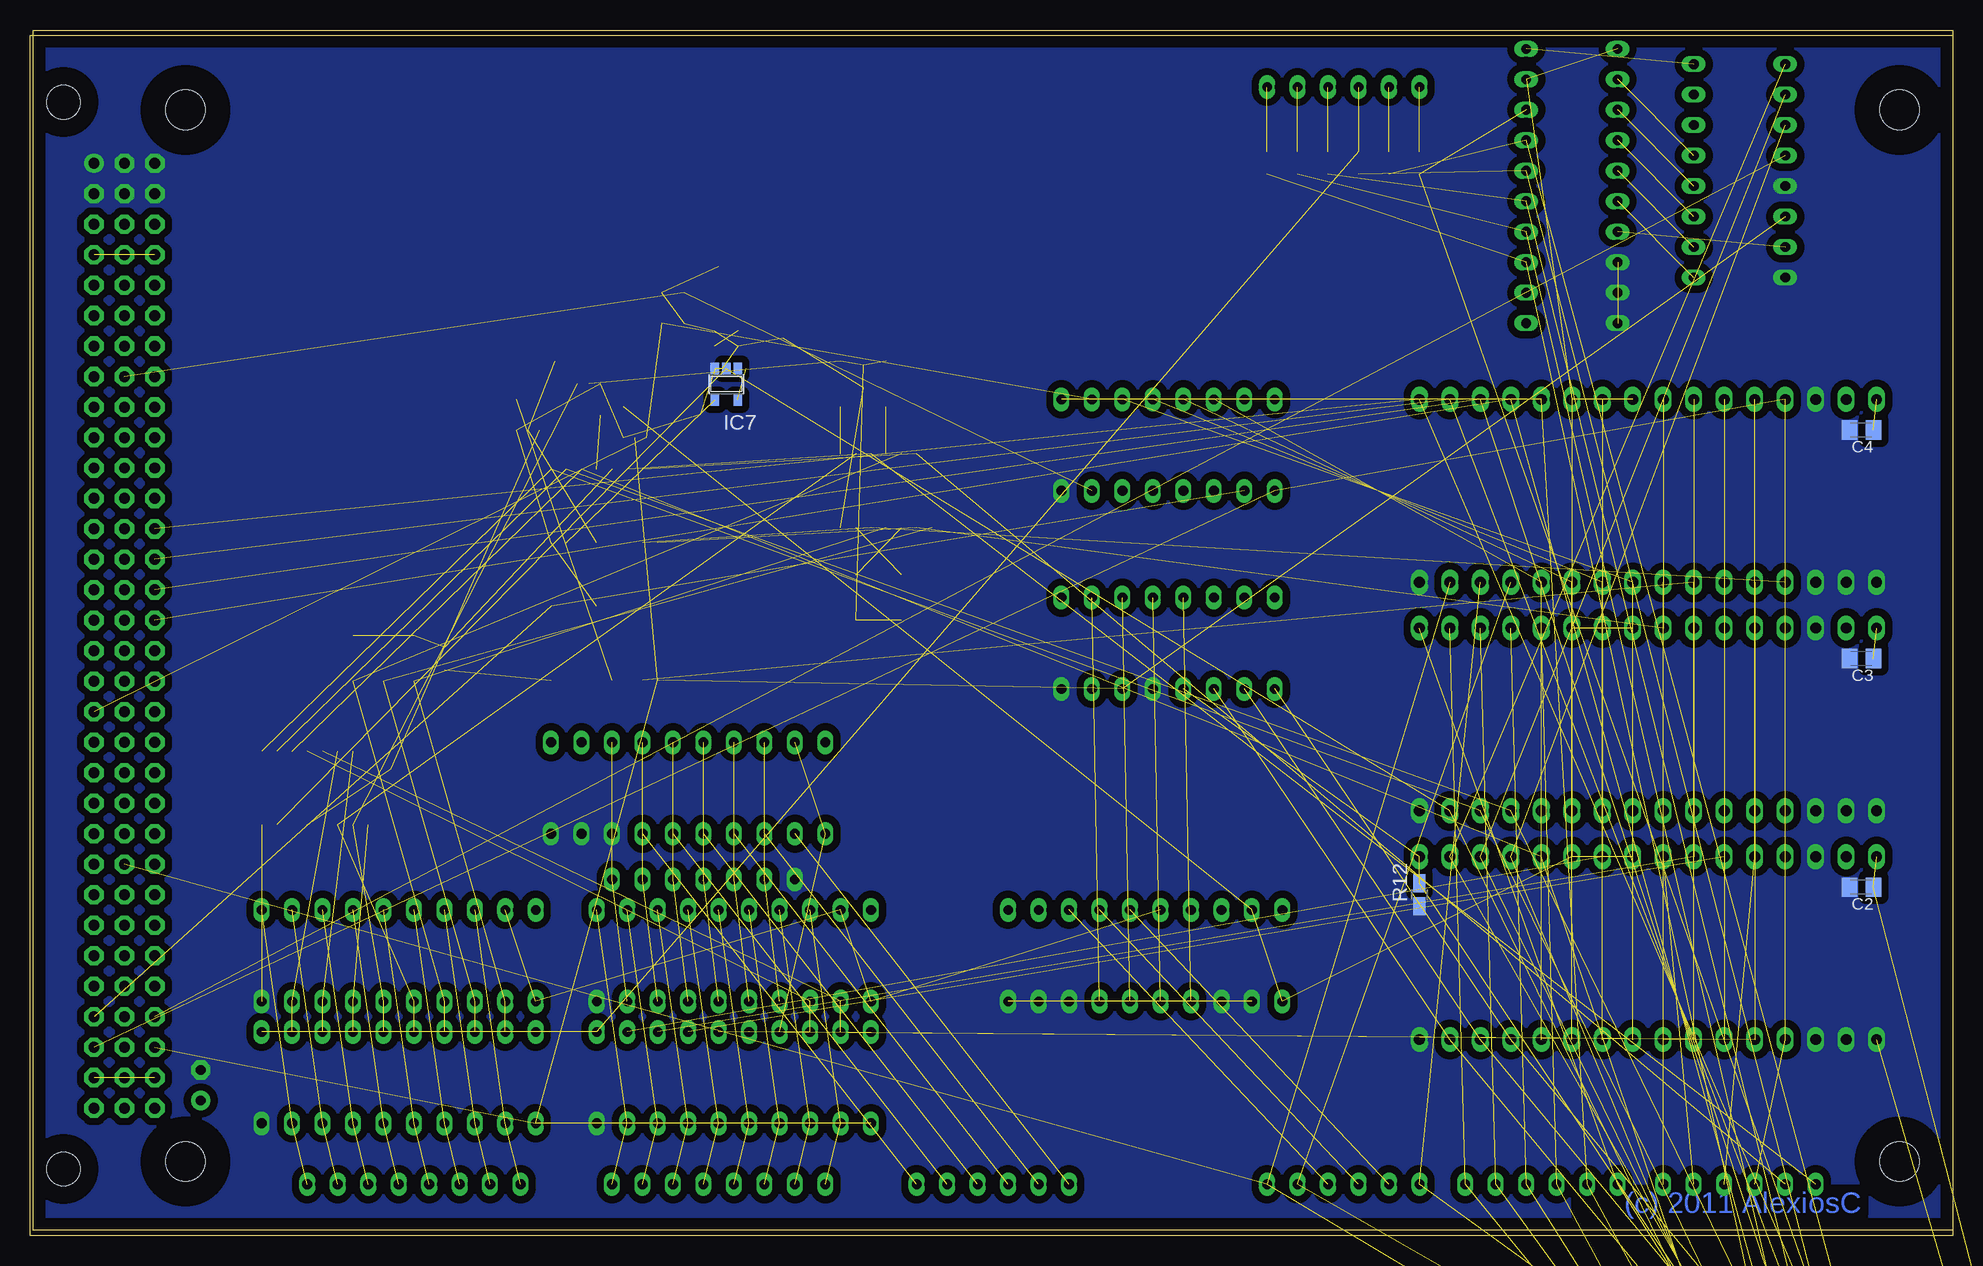
[diagram p5: board, bottom side, seen from below]

Size 160 x 100 mm. Coordinates in mm from the lower left corner, seen from the top.
Outline: 0,0 160,0 160,100 0,100 0,0
Copper layers (1*16): off 0.035mm / dielectric 1.5mm / Bottom 0.035mm
Design rules "cft-olimex-10mil-small-pads-tented-vias": minimum track width 10mil, minimum drill 24mil, track to track 10mil, track to pad 10mil, pad to pad 10mil, via to via 10mil, smd to smd 10mil, copper to edge 40mil, drill to drill 10mil, minimum pad ring 10mil, minimum via ring 12mil, stop-mask expansion 4mil, vias tented up to drill 30mil, thermal gap 10mil

### Footprints (pad centres in the part's own frame; a part is rotated, then mirrored left to right if it is on the bottom)
C0805K = smd 1.3 x 1.6: 1 -1,0; 2 1,0
E2,5-5 = drill 0.813 pad 1.6 round: + -1.27,0 | drill 0.813 pad 1.6 octagon: - 1.27,0
SOD123 = smd 1.4 x 1.4: A 1.9,0; C -1.9,0
VG96K = drill 0.914 pad 1.6 round: A1 154.94,39.37 | drill 0.914 pad 1.6 octagon: A2 154.94,36.83; A3 154.94,34.29; A4 154.94,31.75; A5 154.94,29.21; A6 154.94,26.67; A7 154.94,24.13; A8 154.94,21.59; A9 154.94,19.05; A10 154.94,16.51; A11 154.94,13.97; A12 154.94,11.43; A13 154.94,8.89; A14 154.94,6.35; A15 154.94,3.81; A16 154.94,1.27; A17 154.94,-1.27; A18 154.94,-3.81; A19 154.94,-6.35; A20 154.94,-8.89; A21 154.94,-11.43; A22 154.94,-13.97; A23 154.94,-16.51; A24 154.94,-19.05; A25 154.94,-21.59; A26 154.94,-24.13; A27 154.94,-26.67; A28 154.94,-29.21; A29 154.94,-31.75; A30 154.94,-34.29; A31 154.94,-36.83; A32 154.94,-39.37; B1 152.4,39.37; B2 152.4,36.83; B3 152.4,34.29; B4 152.4,31.75; B5 152.4,29.21; B6 152.4,26.67; B7 152.4,24.13; B8 152.4,21.59; B9 152.4,19.05; B10 152.4,16.51; B11 152.4,13.97; B12 152.4,11.43; B13 152.4,8.89; B14 152.4,6.35; B15 152.4,3.81; B16 152.4,1.27; B17 152.4,-1.27; B18 152.4,-3.81; B19 152.4,-6.35; B20 152.4,-8.89; B21 152.4,-11.43; B22 152.4,-13.97; B23 152.4,-16.51; B24 152.4,-19.05; B25 152.4,-21.59; B26 152.4,-24.13; B27 152.4,-26.67; B28 152.4,-29.21; B29 152.4,-31.75; B30 152.4,-34.29; B31 152.4,-36.83; B32 152.4,-39.37; C1 149.86,39.37; C2 149.86,36.83; C3 149.86,34.29; C4 149.86,31.75; C5 149.86,29.21; C6 149.86,26.67; C7 149.86,24.13; C8 149.86,21.59; C9 149.86,19.05; C10 149.86,16.51; C11 149.86,13.97; C12 149.86,11.43; C13 149.86,8.89; C14 149.86,6.35; C15 149.86,3.81; C16 149.86,1.27; C17 149.86,-1.27; C18 149.86,-3.81; C19 149.86,-6.35; C20 149.86,-8.89; C21 149.86,-11.43; C22 149.86,-13.97; C23 149.86,-16.51; C24 149.86,-19.05; C25 149.86,-21.59; C26 149.86,-24.13; C27 149.86,-26.67; C28 149.86,-29.21; C29 149.86,-31.75; C30 149.86,-34.29; C31 149.86,-36.83; C32 149.86,-39.37 | hole 2.794: 157.48,44.45; 157.48,-44.45
STANDOFF_28_60 = hole 3.302: 0,0
SOT23-5 = smd 0.69 x 0.99: 1 -0.95,-1.29; 2 0,-1.29; 3 0.95,-1.29; 4 0.95,1.3; 5 -0.95,1.3
DIL16 = drill 0.813 long: 1 -8.89,-3.81; 2 -6.35,-3.81; 3 -3.81,-3.81; 4 -1.27,-3.81; 5 1.27,-3.81; 6 3.81,-3.81; 7 6.35,-3.81; 8 8.89,-3.81; 9 8.89,3.81; 10 6.35,3.81; 11 3.81,3.81; 12 1.27,3.81; 13 -1.27,3.81; 14 -3.81,3.81; 15 -6.35,3.81; 16 -8.89,3.81
SO14 = smd 0.66 x 2.032: 1 -3.81,-3.073; 2 -2.54,-3.073; 3 -1.27,-3.073; 4 0,-3.073; 5 1.27,-3.073; 6 2.54,-3.073; 7 3.81,-3.073; 8 3.81,3.073; 9 2.54,3.073; 10 1.27,3.073; 11 0,3.073; 12 -1.27,3.073; 13 -2.54,3.073; 14 -3.81,3.073
SO16 = smd 0.66 x 2.032: 1 -4.445,-3.073; 2 -3.175,-3.073; 3 -1.905,-3.073; 4 -0.635,-3.073; 5 0.635,-3.073; 6 1.905,-3.073; 7 3.175,-3.073; 8 4.445,-3.073; 9 4.445,3.073; 10 3.175,3.073; 11 1.905,3.073; 12 0.635,3.073; 13 -0.635,3.073; 14 -1.905,3.073; 15 -3.175,3.073; 16 -4.445,3.073
DIL20 = drill 0.813 long: 1 -11.43,-3.81; 2 -8.89,-3.81; 3 -6.35,-3.81; 4 -3.81,-3.81; 5 -1.27,-3.81; 6 1.27,-3.81; 7 3.81,-3.81; 8 6.35,-3.81; 9 8.89,-3.81; 10 11.43,-3.81; 11 11.43,3.81; 12 8.89,3.81; 13 6.35,3.81; 14 3.81,3.81; 15 1.27,3.81; 16 -1.27,3.81; 17 -3.81,3.81; 18 -6.35,3.81; 19 -8.89,3.81; 20 -11.43,3.81
FE08 = drill 0.813 long: 1 -8.89,0; 2 -6.35,0; 3 -3.81,0; 4 -1.27,0; 5 1.27,0; 6 3.81,0; 7 6.35,0; 8 8.89,0
FE06 = drill 0.813 long: 1 -6.35,0; 2 -3.81,0; 3 -1.27,0; 4 1.27,0; 5 3.81,0; 6 6.35,0
R0805W = smd 1.5 x 1: 1 -0.94,0; 2 0.94,0
R0805 = smd 1.3 x 1.5: 1 -0.95,0; 2 0.95,0
SIL7 = drill 0.813 long: 1 -7.62,0; 2 -5.08,0; 3 -2.54,0; 4 0,0; 5 2.54,0; 6 5.08,0; 7 7.62,0
SIL9 = drill 0.813 long: 1 -10.16,0; 2 -7.62,0; 3 -5.08,0; 4 -2.54,0; 5 0,0; 6 2.54,0; 7 5.08,0; 8 7.62,0; 9 10.16,0
SIL4 = drill 0.813 long: 1 -3.81,0; 2 -1.27,0; 3 1.27,0; 4 3.81,0
SIL6 = drill 0.813 long: 1 -6.35,0; 2 -3.81,0; 3 -1.27,0; 4 1.27,0; 5 3.81,0; 6 6.35,0
DIL32 = drill 0.9 long: 1 -19.05,-7.62; 2 -16.51,-7.62; 3 -13.97,-7.62; 4 -11.43,-7.62; 5 -8.89,-7.62; 6 -6.35,-7.62; 7 -3.81,-7.62; 8 -1.27,-7.62; 9 1.27,-7.62; 10 3.81,-7.62; 11 6.35,-7.62; 12 8.89,-7.62; 13 11.43,-7.62; 14 13.97,-7.62; 15 16.51,-7.62; 16 19.05,-7.62; 17 19.05,7.62; 18 16.51,7.62; 19 13.97,7.62; 20 11.43,7.62; 21 8.89,7.62; 22 6.35,7.62; 23 3.81,7.62; 24 1.27,7.62; 25 -1.27,7.62; 26 -3.81,7.62; 27 -6.35,7.62; 28 -8.89,7.62; 29 -11.43,7.62; 30 -13.97,7.62; 31 -16.51,7.62; 32 -19.05,7.62

### Placement (x,y rotation side)
C1  96.52,74.3 180 top
C2  7.62,28.57 180 bottom
C3  7.62,47.62 180 bottom
C4  7.62,66.67 180 bottom
C5  105.41,67.94 180 top
C6  102.87,81.28 270 top
C7  101.6,71.75 0 top
C8  102.23,73.66 180 top
C9  102.23,74.93 0 top
C10  146.05,12.06 90 top
D1  87.63,52.7 90 top
D2  91.44,52.7 90 top
D3  88.9,70.48 270 top
D4  92.71,70.48 270 top
D5  128.27,47.62 270 top
D6  130.81,47.62 270 top
D7  133.35,47.62 270 top
EXP1  0,49.53 0 top
H1  4.45,93.34 0 top
H2  147.32,93.34 0 top
H3  147.32,5.71 0 top
H4  4.45,5.71 0 top
IC1  109.86,67.31 0 top
IC2  17.78,88.27 270 top
IC3  65.41,65.41 0 top
IC4  65.41,48.9 0 top
IC5  88.9,61.59 0 top
IC6  113.67,69.22 180 top
IC7  102.23,70.48 180 bottom
IC8  136.53,36.83 0 top
IC9  112.39,60.33 0 top
IC10  112.39,48.9 0 top
IC11  129.54,12.7 0 top
IC12  101.6,12.7 0 top
IC13  105.41,36.83 0 top
IC14  129.54,22.86 0 top
IC15  101.6,22.86 0 top
IC16  31.75,87 270 top
IC17  67.31,22.86 0 top
IC22  118.75,67.94 0 top
P1  128.27,3.81 0 top
P2  102.87,3.81 0 top
P3  50.8,95.25 0 top
P4  50.8,3.81 0 top
P5  80.01,3.81 0 top
P6  17.78,3.81 0 top
P7  34.29,3.81 0 top
R1  106.68,78.11 180 top
R2  106.68,75.56 0 top
R3  44.45,88.9 90 top
R4  46.99,88.9 90 top
R5  49.53,88.9 90 top
R6  52.07,88.9 90 top
R7  54.61,88.9 90 top
R8  57.15,88.9 90 top
R12  44.45,27.94 90 bottom
R33  90.81,71.12 270 top
R34  125.73,47.62 270 top
R35  130.18,39.37 270 top
R39  115.57,72.39 0 top
RN1  104.14,29.21 0 top
RN3  1.27,-31.11 0 top  (outside the outline)
RN4  -6.35,-56.52 0 top  (outside the outline)
RN5  -3.17,-61.59 0 top  (outside the outline)
RN8  1.27,-36.2 0 top  (outside the outline)
RN10  -3.17,-51.44 0 top  (outside the outline)
U$1  144.15,102.87 0 top
UROM1  25.4,23.5 0 top
UROM2  25.4,42.55 0 top
UROM3  25.4,61.59 0 top

### Tracks (layer width: path | path; a pad name or v marks a point on that pad's centre or on a via)
!CLI  (2 unrouted)
!CLL  (2 unrouted)
!CPL  (2 unrouted)
!END  (3 unrouted)
!HALT  (3 unrouted)
!INCAC  (2 unrouted)
!INCDR  (2 unrouted)
!INCPC  (2 unrouted)
!IO  (2 unrouted)
!IRQS  (3 unrouted)
!MEM  (2 unrouted)
!OPIF3  (1 unrouted)
!R  (2 unrouted)
!RAC  (1 unrouted)
!RAGL  (4 unrouted)
!RDR  (1 unrouted)
!RESET  (6 unrouted)
!RPC  (1 unrouted)
!RSTHOLD  (4 unrouted)
!SKIP  (3 unrouted)
!STI  (2 unrouted)
!UCE  (10 unrouted)
!W  (2 unrouted)
!WAC  (1 unrouted)
!WALU  (1 unrouted)
!WAR  (1 unrouted)
!WDR  (1 unrouted)
!WIR  (3 unrouted)
!WPC  (1 unrouted)
!WS  (2 unrouted)
+3.3V  (2 unrouted)
+12V  (2 unrouted)
AINDEX  (3 unrouted)
CLK1  (2 unrouted)
CLK5  (1 unrouted)
FL  (5 unrouted)
FNEG  (2 unrouted)
FV  (5 unrouted)
FZERO  (2 unrouted)
GND  (25 unrouted)
  pour Bottom (isolate 0.61, rank 6, no thermals): 0,99.69 0,0 160.02,0 160.02,99.69
  pour off (isolate 0.61, rank 5, no thermals): 117.16,62.23 117.16,58.42 116.52,58.42 116.52,59.05 107.63,59.05 107.63,62.23
  pour off (isolate 0.61, rank 5, no thermals): 117.16,52.07 117.16,45.72 108.9,45.72 108.9,52.07
  pour off (isolate 0.61, rank 5, no thermals): 133.03,50.8 133.03,44.45 124.78,44.45 124.78,50.8
IBUS0  (2 unrouted)
IBUS1  (2 unrouted)
IBUS2  (2 unrouted)
IBUS3  (2 unrouted)
IBUS4  (2 unrouted)
IBUS5  (2 unrouted)
IBUS6  (2 unrouted)
IBUS7  (2 unrouted)
IBUS8  (2 unrouted)
IBUS9  (2 unrouted)
IBUS10  (2 unrouted)
IBUS11  (2 unrouted)
IBUS12  (2 unrouted)
IBUS13  (2 unrouted)
IBUS14  (2 unrouted)
IBUS15  (2 unrouted)
IR0  (3 unrouted)
IR1  (3 unrouted)
IR2  (3 unrouted)
IR3  (3 unrouted)
IR4  (3 unrouted)
IR5  (2 unrouted)
IR6  (2 unrouted)
IR7  (2 unrouted)
IR8  (2 unrouted)
IR9  (2 unrouted)
IR10  (2 unrouted)
IR11  (3 unrouted)
IR12  (3 unrouted)
IR13  (3 unrouted)
IR14  (3 unrouted)
IR15  (3 unrouted)
N$1  (2 unrouted)
N$2  (2 unrouted)
N$7  (1 unrouted)
N$8  (1 unrouted)
N$9  (1 unrouted)
N$10  (1 unrouted)
N$11  (1 unrouted)
N$12  (1 unrouted)
N$13  (2 unrouted)
N$14  (2 unrouted)
N$15  (2 unrouted)
N$16  (2 unrouted)
N$19  (1 unrouted)
N$20  (1 unrouted)
N$21  (1 unrouted)
N$22  (1 unrouted)
N$66  (5 unrouted)
OP1_BRANCH  (1 unrouted)
OP2_ROLL  (4 unrouted)
OPIF0  (3 unrouted)
OPIF1  (3 unrouted)
OPIF2  (3 unrouted)
OPIF3  (3 unrouted)
PAGE0  (2 unrouted)
PAGE1  (2 unrouted)
PAGE2  (2 unrouted)
PAGE3  (2 unrouted)
PAGE4  (2 unrouted)
PAGE5  (2 unrouted)
PC10  (1 unrouted)
PC11  (1 unrouted)
PC12  (1 unrouted)
PC13  (1 unrouted)
PC14  (1 unrouted)
PC15  (1 unrouted)
RUNIT0  (2 unrouted)
RUNIT1  (2 unrouted)
RUNIT2  (2 unrouted)
RUNIT3  (3 unrouted)
SKIP0  (1 unrouted)
SKIPMUXHI  (2 unrouted)
SKIPMUXLO  (2 unrouted)
SL  (1 unrouted)
SN  (1 unrouted)
SV  (1 unrouted)
SZ  (1 unrouted)
UINSTR18  (3 unrouted)
UPC0  (3 unrouted)
UPC1  (3 unrouted)
UPC2  (3 unrouted)
UPC3  (3 unrouted)
VCC  (9 unrouted)
  pour off (isolate 0.61, rank 6, no thermals): 0,99.69 0,0 160.02,0 160.02,99.69
WUNIT0  (2 unrouted)
WUNIT1  (2 unrouted)
WUNIT2  (2 unrouted)

### Text on the board
off: (c) 2012 AlexiosC
Bottom: (c) 2011 AlexiosC
tNames: Microcode v.4 or newer only! | Microcode ROMs | AGL LSB | AGL MSB | IR LSB | Skip/Branch Unit | Write Unit Decoder | IR MSB | uPC | http://www.bedroomlan.org/cft | (c) 2012 AlexiosC | CFT Control Unit Rev F